# Altium project externboard.PrjPcb
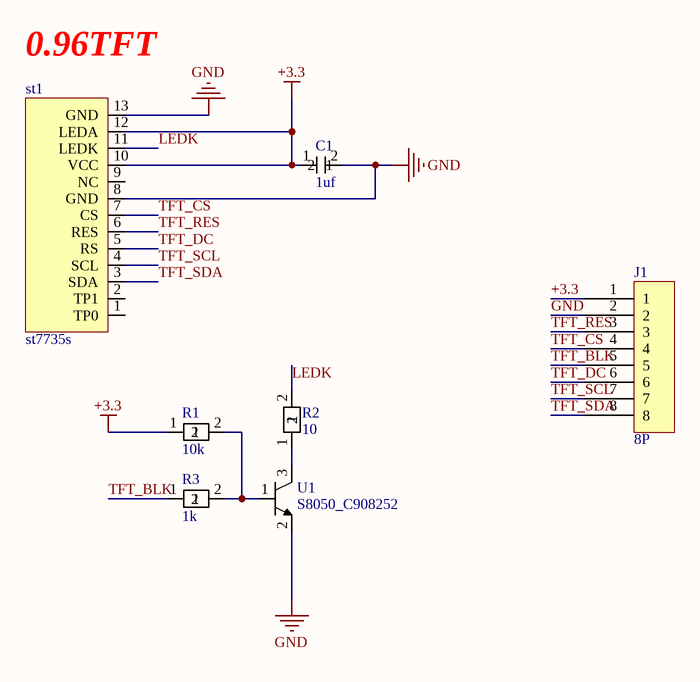
[diagram p0: extern.SchDoc]
1 sheet, 7 parts. Net scope: global (net labels, ports and power ports of the same name join across sheets).
Board file: extern.PcbDoc

## Sheet extern.SchDoc
size OrCAD A

### Parts
C1  1uf  [C0805]
J1  8P  [8P-P2.54]
R1  10k  [R0805]
R2  10  [R0805]
R3  1k  [R0805]
st1  st7735s  [st7735s]
U1  S8050_C908252  [s8050]

### Nets
+3.3: C1.1 J1.1 R1.1 st1.10(VCC) st1.12(LEDA)
GND: C1.2 J1.2 st1.8(GND) st1.13(GND) U1.2(E)
LEDK: R2.2 st1.11(LEDK)
TFT_BLK: J1.5 R3.1
TFT_CS: J1.4 st1.7(CS)
TFT_DC: J1.6 st1.5(RS)
TFT_RES: J1.3 st1.6(RES)
TFT_SCL: J1.7 st1.4(SCL)
TFT_SDA: J1.8 st1.3(SDA)
NetR1_2: R1.2 R3.2 U1.1(B)
NetR2_1: R2.1 U1.3(C)

Not connected (* = marked no-connect by the designer): st1 1(TP0) 2(TP1) 9(NC)

### Notes on the sheet
- (near st1) 0.96TFT

### Library data of the parts
C1 = C0805
R1-R3 = R0805
U1 = s8050